# EAGLE design power circuit v3 (EAGLE 7.3.0)
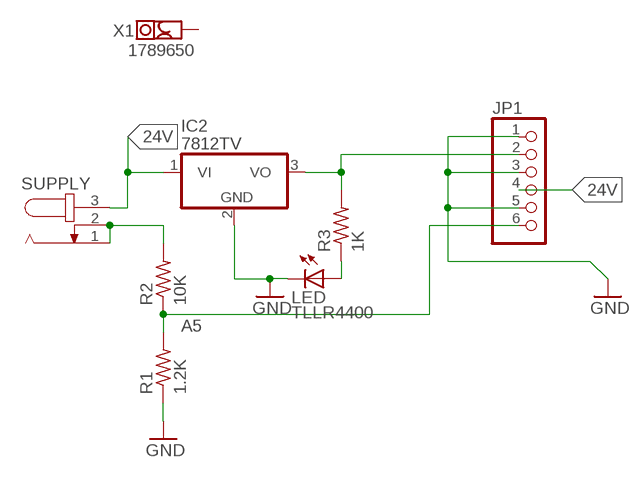
[diagram p0: schematic, sheet 1]

## Parts
IC2  7812TV  [TO220V]
JP1  PINHD-1X6B  [1X06-BIG]
LED  TLLR4400  [LED3MM]
R1  1.2K  R-US_0207/5V  [0207/5V]
R2  10K  R-US_0207/5V  [0207/5V]
R3  1K  R-US_0207/5V  [0207/5V]
SUPPLY  JACK-PLUG1  [SPC4078]
X1  1789650  [1789650]

## Nets
24V: IC2.1(VI) JP1.4 SUPPLY.3
A5: JP1.6 R1.2 R2.1
GND: IC2.2(GND) JP1.1 JP1.3 JP1.5 LED.K(C) R1.1
N$1: LED.A R3.1
N$2: IC2.3(VO) JP1.2 R3.2
N$4: R2.2 SUPPLY.1 SUPPLY.2
Unconnected: X1.A(1A) X1.B(1A)

## Library data of the parts
IC2 = myParts:78*: Positive VOLTAGE REGULATOR Source: http://cache.national.com/ds/LM/LM78L05.pdf http://www.fairchildsemi.com/ds/LM/LM7805.pdf
JP1 = adafruit:PINHD-1X6: PIN HEADER
LED = led:TLLR4400: Low Current (2mA) LED 3 mm Tinted Diffused Package color RED Source: Data sheet <http://www.farnell.com/datasheets/391100.pdf>; MF: VISHAY SEMICONDUCTOR; OC_FARNELL: 1612437
R1-R3 = adafruit:R-US_: RESISTOR, American symbol
SUPPLY = con-jack:JACK-PLUG: DC POWER JACK Power Jack, DC, Right Angle, Through Hole, Rated 5A at 16VDC, PC Terminals Distributor: Farnell (www.Farnell.de) Drawing: 84N1161.pdf / 84N1162.pdf Manufacturer: SPC Technology (www.spctechnology.com) Type: SPC4077 / SPC 4078; OC_FARNELL: unknown; OC_NEWARK: unknown
X1 = my-con:1789650: FFKDS/H-3,81 Printklemme Nennstrom: 12 A Bemessungsspannung: 160 V Raster: 3,81 mm Polzahl: 1 Montageart: Löten Anschlussart:Federkraftanschluss Anschlussrichtung vom Leiter zur Platine: 0° Source: 1789650.pdf; OC_FARNELL: unknown; OC_NEWARK: unknown

## Board
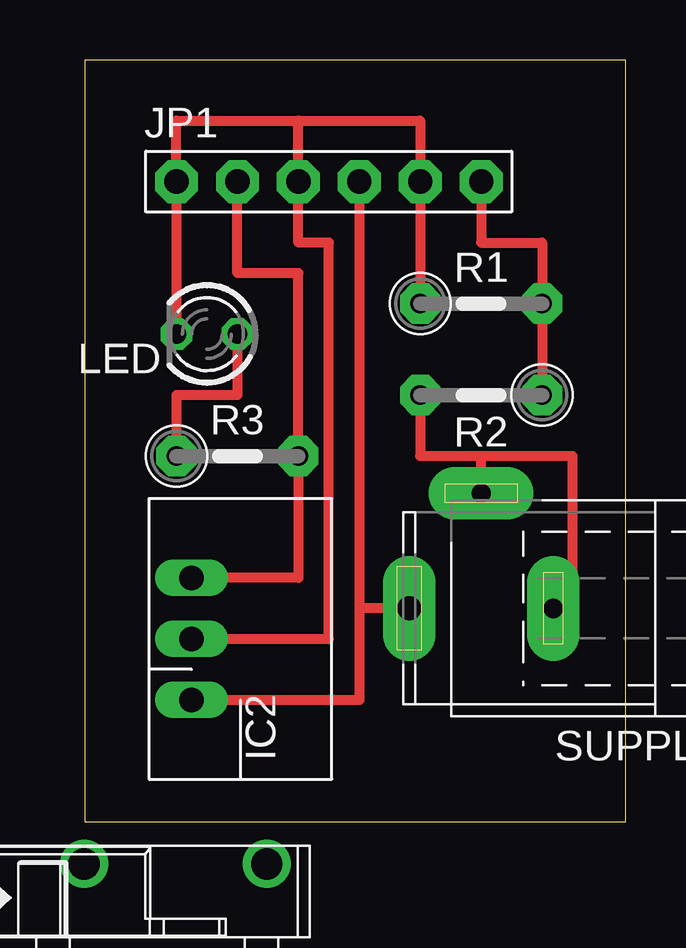
[diagram p1: board, top side]

Size 22.53 x 31.74 mm. Coordinates in mm from the lower left corner, seen from the top.
Outline: 0,0 22.53,0 22.53,31.74 0,31.74 0,0
Copper layers (1*16): Top 0.035mm / dielectric 1.5mm / Bottom 0.035mm
Design rules "default": minimum track width 10mil, minimum drill 24mil, track to track 8mil, track to pad 8mil, pad to pad 8mil, via to via 8mil, smd to smd 8mil, copper to edge 40mil, drill to drill 8mil, minimum pad ring 10mil, minimum via ring 8mil, stop-mask expansion 4mil, vias tented up to drill 0mil, thermal gap 10mil

### Footprints (pad centres in the part's own frame; a part is rotated, then mirrored left to right if it is on the bottom)
TO220V = drill 1.016 long: 1 -2.54,-2.54; 2 0,-2.54; 3 2.54,-2.54
1X06-BIG = drill 1.016 pad 1.778 octagon: 1 -6.35,0; 2 -3.81,0; 3 -1.27,0; 4 1.27,0; 5 3.81,0; 6 6.35,0
LED3MM = drill 0.813 octagon: A -1.27,0; K 1.27,0
0207/5V = drill 0.813 pad 1.676 octagon: 1 -2.54,0; 2 2.54,0
SPC4078 = drill 0.8 pad 2.184 long: 1 -3,0; 2 0,-4.8 | drill 1 pad 2.184 long: 3 3,0
1789650 = drill 1.3 pad 2: A -2.58,2.054; B 5.04,2.054

### Placement (x,y rotation side)
IC2  1.91,7.62 90 top
JP1  10.16,26.67 0 top
LED  5.08,20.32 180 top
R1  16.51,21.59 0 top
R2  16.51,17.78 180 top
R3  6.35,15.24 0 top
SUPPLY  16.51,8.89 180 top
X1  2.54,-3.81 0 top

### Tracks (layer width: path | path; a pad name or v marks a point on that pad's centre or on a via)
24V
  Top 0.406: SUPPLY.3 11.43,8.89 | 11.43,8.89 11.43,5.08 IC2.1 | JP1.4 11.43,8.89
A5
  Top 0.406: JP1.6 16.51,24.13 19.05,24.13 R1.2 R2.1
GND
  Top 0.406: LED.K JP1.1 3.81,29.21 8.89,29.21 | R1.1 JP1.5 13.97,29.21 8.89,29.21 | 8.89,29.21 JP1.3 8.89,24.13 10.16,24.13 10.16,7.62 IC2.2
N$1
  Top 0.406: LED.A 6.35,17.78 3.81,17.78 R3.1
N$2
  Top 0.406: JP1.2 6.35,22.86 8.89,22.86 R3.2 8.89,10.16 IC2.3
N$4
  Top 0.406: R2.2 13.97,15.24 16.51,15.24 | SUPPLY.2 16.51,15.24 | SUPPLY.1 20.32,8.89 20.32,15.24 16.51,15.24